# Altium schematic sheet Cloud Upload.SchDoc
size A; SheetNumber: 5; SheetTotal: 7
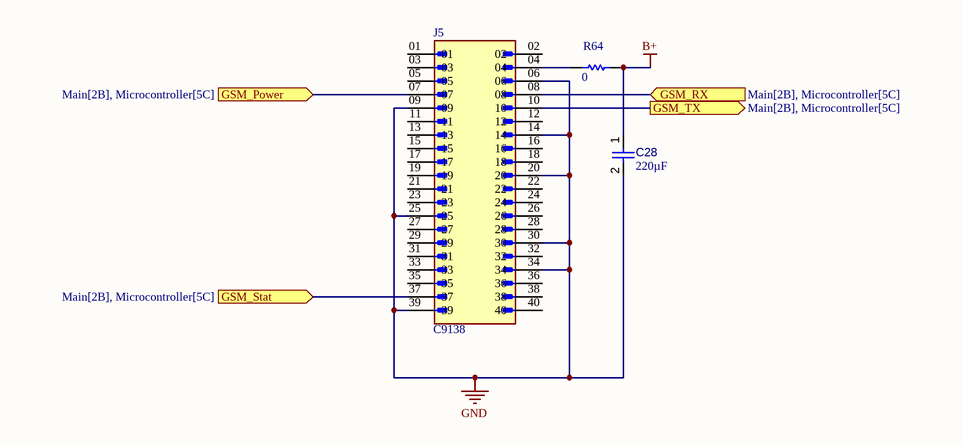
[diagram p0: Cloud Upload.SchDoc]

## Parts
C28  value 220µF  [FP-FTD8-MFG]  (hidden comment: EEEFTE221XAP)
J5  C9138  [AMPHENOL_10129381-940001BLF]
R64  value 0  [RESC1608X55X25ML10T15]  (hidden comment: Resistor 0R +/- 5% 0603 100 mW)

## Ports
GSM_Power (in, see Main[2B], Microcontroller[5C]), GSM_RX (in, see Main[2B], Microcontroller[5C]), GSM_Stat (in, see Main[2B], Microcontroller[5C]), GSM_TX (out, see Main[2B], Microcontroller[5C])

## Nets
B+: C28.1 R64.2
GND: C28.2 J5.06 J5.09 J5.14 J5.20 J5.25 J5.30 J5.34 J5.39
GSM_Power: J5.07 ; port GSM_Power
GSM_RX: J5.08 ; port GSM_RX
GSM_Stat: J5.37 ; port GSM_Stat
GSM_TX: J5.10 ; port GSM_TX
NetJ5_04: J5.04 R64.1

Not connected (* = marked no-connect by the designer): J5 01 02 03 05 11 12 13 15 16 17 18 19 21 22 23 24 26 27 28 29 31 32 33 35 36 38 40

## Library data of the parts
C28 = CMP-001-00089-1: Radial Can - SMD ALUMINUM ELECTROLYTIC CAPACITOR FT 25V 220muF 卤20% 0.248Dia 6.30mm; Tolerance: 20%; Ripple Current: 600mA; Voltage Rating: 25V; Mounting Technology: Surface Mount; Case/Package: Radial; Max Operating Temperature: 105°C; Min Operating Temperature: -55°C; Ripple Current (AC): 600mA
J5 = CMP-002-00076-1: MF: Amphenol ICC (FCI); Pins: 40; Case/Package: None; Source: 10129381-940001BLF.SchLib; Design Item ID: 10129381-940001BLF; MP: 10129381-940001BLF; Value: *; Component Type: Standard; Availability: Unavailable; Price: None; Manufacturer Part Search: C9138; Manufacturer Part Number 1: 10129381-940001BLF
R64 = CMP-009-00006-5: Chip Resistor, 0 Ohm, 0.1 W, -55 to 155 degC, 0603 (1608 Metric); Power: 100mW; Voltage Rating: 50V; Max Operating Temperature: 155°C; RoHS Compliant: True; Mounting Technology: SM; Case/Package: 0603; Min Operating Temperature: -55°C; Tolerance: 5%; Pins: 2